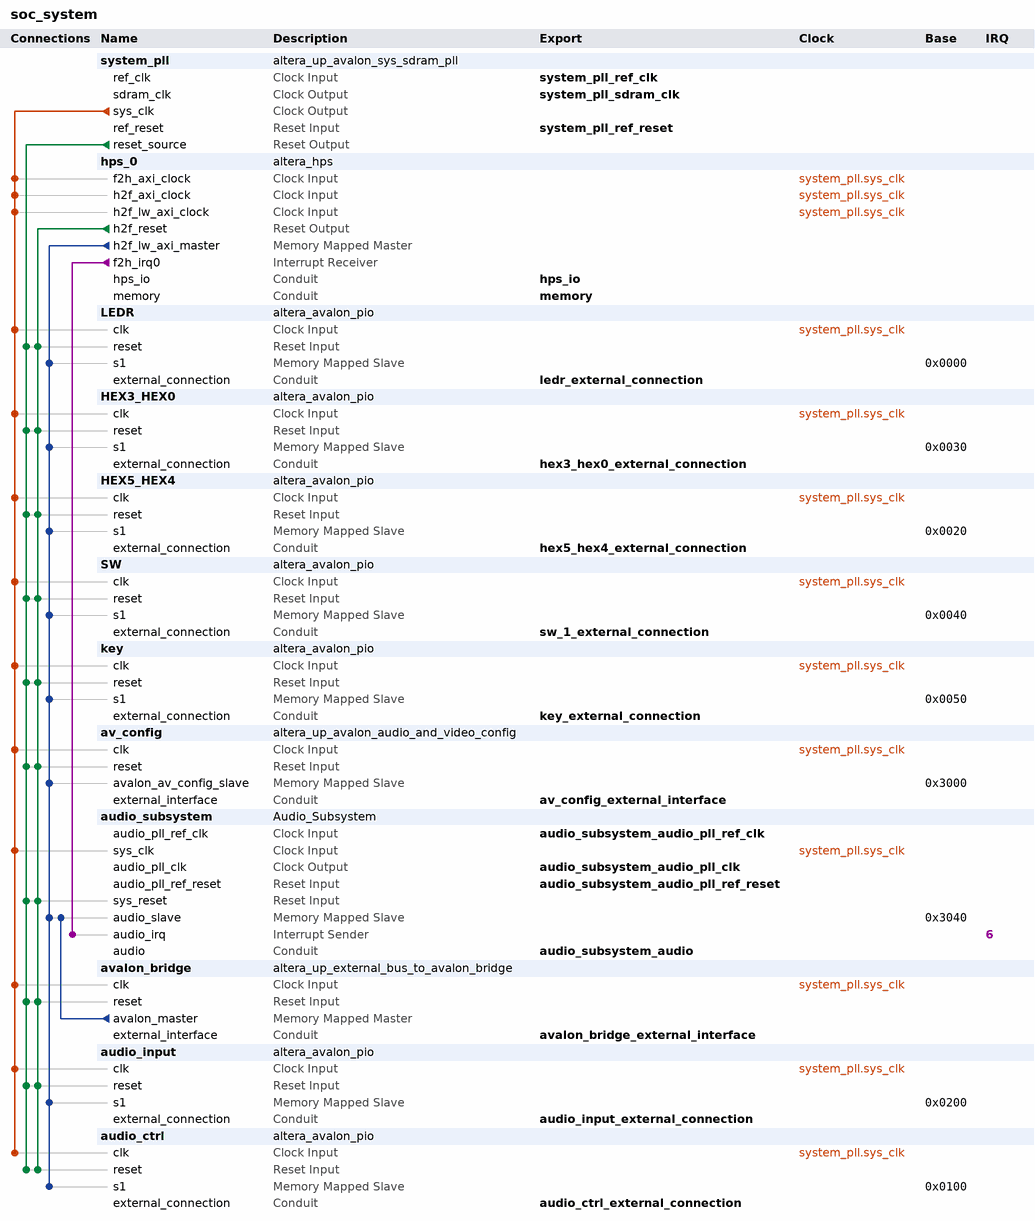
[diagram p0: system contents]
# Platform Designer (Qsys) system soc_system, Cyclone V 5CSEMA5F31C6
# Parameters at their usual value, and those the tool derives, are not listed.
package require -exact qsys 17.1
create_system soc_system
set_project_property DEVICE_FAMILY {Cyclone V}
set_project_property DEVICE 5CSEMA5F31C6

add_instance system_pll altera_up_avalon_sys_sdram_pll 17.0
set_instance_parameter_value system_pll CV_boards DE1-SoC
set_instance_parameter_value system_pll gui_outclk 100.0
set_instance_parameter_value system_pll gui_refclk 50.0

add_instance hps_0 altera_hps 17.1
set_instance_parameter_value hps_0 EMAC1_Mode RGMII
set_instance_parameter_value hps_0 EMAC1_PinMuxing {HPS I/O Set 0}
set_instance_parameter_value hps_0 F2SCLK_COLDRST_Enable false
set_instance_parameter_value hps_0 F2SCLK_DBGRST_Enable false
set_instance_parameter_value hps_0 F2SCLK_WARMRST_Enable false
set_instance_parameter_value hps_0 F2SINTERRUPT_Enable true
set_instance_parameter_value hps_0 F2S_Width 2
set_instance_parameter_value hps_0 FPGA_PERIPHERAL_OUTPUT_CLOCK_FREQ_EMAC0_GTX_CLK 125
set_instance_parameter_value hps_0 FPGA_PERIPHERAL_OUTPUT_CLOCK_FREQ_EMAC0_MD_CLK 2.5
set_instance_parameter_value hps_0 FPGA_PERIPHERAL_OUTPUT_CLOCK_FREQ_EMAC1_GTX_CLK 125
set_instance_parameter_value hps_0 FPGA_PERIPHERAL_OUTPUT_CLOCK_FREQ_EMAC1_MD_CLK 2.5
set_instance_parameter_value hps_0 HPS_PROTOCOL DDR3
set_instance_parameter_value hps_0 I2C0_Mode I2C
set_instance_parameter_value hps_0 I2C0_PinMuxing {HPS I/O Set 0}
set_instance_parameter_value hps_0 I2C1_Mode I2C
set_instance_parameter_value hps_0 I2C1_PinMuxing {HPS I/O Set 0}
set_instance_parameter_value hps_0 LWH2F_Enable true
set_instance_parameter_value hps_0 MEM_BANKADDR_WIDTH 3
set_instance_parameter_value hps_0 MEM_CLK_FREQ 400.0
set_instance_parameter_value hps_0 MEM_COL_ADDR_WIDTH 10
set_instance_parameter_value hps_0 MEM_DQ_WIDTH 32
set_instance_parameter_value hps_0 MEM_DRV_STR RZQ/7
set_instance_parameter_value hps_0 MEM_ROW_ADDR_WIDTH 15
set_instance_parameter_value hps_0 MEM_RTT_NOM RZQ/4
set_instance_parameter_value hps_0 MEM_RTT_WR RZQ/4
set_instance_parameter_value hps_0 MEM_TCL 11
set_instance_parameter_value hps_0 MEM_TFAW_NS 30.0
set_instance_parameter_value hps_0 MEM_TRAS_NS 35.0
set_instance_parameter_value hps_0 MEM_TRCD_NS 13.75
set_instance_parameter_value hps_0 MEM_TRFC_NS 260.0
set_instance_parameter_value hps_0 MEM_TRP_NS 13.75
set_instance_parameter_value hps_0 MEM_VENDOR JEDEC
set_instance_parameter_value hps_0 MEM_WTCL 8
set_instance_parameter_value hps_0 QSPI_Mode {1 SS}
set_instance_parameter_value hps_0 QSPI_PinMuxing {HPS I/O Set 0}
set_instance_parameter_value hps_0 REF_CLK_FREQ 25.0
set_instance_parameter_value hps_0 S2FCLK_USER2CLK 5
set_instance_parameter_value hps_0 S2F_Width 3
set_instance_parameter_value hps_0 SDIO_Mode {4-bit Data}
set_instance_parameter_value hps_0 SDIO_PinMuxing {HPS I/O Set 0}
set_instance_parameter_value hps_0 SPIM1_Mode {Single Slave Select}
set_instance_parameter_value hps_0 SPIM1_PinMuxing {HPS I/O Set 0}
set_instance_parameter_value hps_0 STM_Enable false
set_instance_parameter_value hps_0 TIMING_BOARD_AC_SKEW 0.03
set_instance_parameter_value hps_0 TIMING_BOARD_AC_TO_CK_SKEW 0.0
set_instance_parameter_value hps_0 TIMING_BOARD_DQ_TO_DQS_SKEW 0.0
set_instance_parameter_value hps_0 TIMING_BOARD_MAX_CK_DELAY 0.03
set_instance_parameter_value hps_0 TIMING_BOARD_MAX_DQS_DELAY 0.02
set_instance_parameter_value hps_0 TIMING_BOARD_SKEW_BETWEEN_DQS 0.08
set_instance_parameter_value hps_0 TIMING_BOARD_SKEW_CKDQS_DIMM_MAX 0.16
set_instance_parameter_value hps_0 TIMING_BOARD_SKEW_CKDQS_DIMM_MIN 0.06
set_instance_parameter_value hps_0 TIMING_BOARD_SKEW_WITHIN_DQS 0.01
set_instance_parameter_value hps_0 TIMING_TDH 65
set_instance_parameter_value hps_0 TIMING_TDQSCK 255
set_instance_parameter_value hps_0 TIMING_TDQSQ 125
set_instance_parameter_value hps_0 TIMING_TDS 30
set_instance_parameter_value hps_0 TIMING_TIH 140
set_instance_parameter_value hps_0 TIMING_TIS 180
set_instance_parameter_value hps_0 TIMING_TQSH 0.4
set_instance_parameter_value hps_0 UART0_Mode {No Flow Control}
set_instance_parameter_value hps_0 UART0_PinMuxing {HPS I/O Set 0}
set_instance_parameter_value hps_0 USB1_Mode SDR
set_instance_parameter_value hps_0 USB1_PinMuxing {HPS I/O Set 0}
set_instance_parameter_value hps_0 desired_cfg_clk_mhz 100.0
set_instance_parameter_value hps_0 desired_qspi_clk_mhz 400.0

add_instance LEDR altera_avalon_pio 17.1
set_instance_parameter_value LEDR direction Output
set_instance_parameter_value LEDR resetValue 1023
set_instance_parameter_value LEDR width 10

add_instance HEX3_HEX0 altera_avalon_pio 17.1
set_instance_parameter_value HEX3_HEX0 direction Output
set_instance_parameter_value HEX3_HEX0 width 32

add_instance HEX5_HEX4 altera_avalon_pio 17.1
set_instance_parameter_value HEX5_HEX4 direction Output
set_instance_parameter_value HEX5_HEX4 width 16

add_instance SW altera_avalon_pio 17.1
set_instance_parameter_value SW direction Input
set_instance_parameter_value SW simDoTestBenchWiring true
set_instance_parameter_value SW width 10

add_instance key altera_avalon_pio 17.1
set_instance_parameter_value key bitClearingEdgeCapReg true
set_instance_parameter_value key captureEdge true
set_instance_parameter_value key direction Input
set_instance_parameter_value key edgeType FALLING
set_instance_parameter_value key generateIRQ true
set_instance_parameter_value key irqType EDGE
set_instance_parameter_value key simDoTestBenchWiring true
set_instance_parameter_value key width 4

add_instance av_config altera_up_avalon_audio_and_video_config 17.0
set_instance_parameter_value av_config audio_in {Microphone to ADC}
set_instance_parameter_value av_config bit_length 32
set_instance_parameter_value av_config board DE1-SoC
set_instance_parameter_value av_config line_in_bypass true
set_instance_parameter_value av_config sampling_rate {48 kHz}

add_instance audio_subsystem Audio_Subsystem 1.0

add_instance avalon_bridge altera_up_external_bus_to_avalon_bridge 17.1
set_instance_parameter_value avalon_bridge addr_size 64
set_instance_parameter_value avalon_bridge addr_size_multiplier Kbytes
set_instance_parameter_value avalon_bridge data_size 32

add_instance audio_input altera_avalon_pio 17.1
set_instance_parameter_value audio_input bitClearingEdgeCapReg true
set_instance_parameter_value audio_input direction Input
set_instance_parameter_value audio_input edgeType FALLING
set_instance_parameter_value audio_input simDoTestBenchWiring true
set_instance_parameter_value audio_input width 32

add_instance audio_ctrl altera_avalon_pio 17.1
set_instance_parameter_value audio_ctrl bitClearingEdgeCapReg true
set_instance_parameter_value audio_ctrl direction Input
set_instance_parameter_value audio_ctrl edgeType FALLING
set_instance_parameter_value audio_ctrl simDoTestBenchWiring true
set_instance_parameter_value audio_ctrl width 16

# connections
add_connection system_pll.sys_clk audio_ctrl.clk clock
add_connection system_pll.sys_clk audio_input.clk clock
add_connection system_pll.sys_clk audio_subsystem.sys_clk clock
add_connection system_pll.sys_clk av_config.clk clock
add_connection system_pll.sys_clk avalon_bridge.clk clock
add_connection system_pll.sys_clk HEX3_HEX0.clk clock
add_connection system_pll.sys_clk HEX5_HEX4.clk clock
add_connection system_pll.sys_clk hps_0.f2h_axi_clock clock
add_connection system_pll.sys_clk hps_0.h2f_axi_clock clock
add_connection system_pll.sys_clk hps_0.h2f_lw_axi_clock clock
add_connection system_pll.sys_clk key.clk clock
add_connection system_pll.sys_clk LEDR.clk clock
add_connection system_pll.sys_clk SW.clk clock
add_connection hps_0.h2f_reset audio_ctrl.reset reset
add_connection hps_0.h2f_reset audio_input.reset reset
add_connection hps_0.h2f_reset audio_subsystem.sys_reset reset
add_connection hps_0.h2f_reset av_config.reset reset
add_connection hps_0.h2f_reset avalon_bridge.reset reset
add_connection hps_0.h2f_reset HEX3_HEX0.reset reset
add_connection hps_0.h2f_reset HEX5_HEX4.reset reset
add_connection hps_0.h2f_reset key.reset reset
add_connection hps_0.h2f_reset LEDR.reset reset
add_connection hps_0.h2f_reset SW.reset reset
add_connection system_pll.reset_source audio_ctrl.reset reset
add_connection system_pll.reset_source audio_input.reset reset
add_connection system_pll.reset_source audio_subsystem.sys_reset reset
add_connection system_pll.reset_source av_config.reset reset
add_connection system_pll.reset_source avalon_bridge.reset reset
add_connection system_pll.reset_source HEX3_HEX0.reset reset
add_connection system_pll.reset_source HEX5_HEX4.reset reset
add_connection system_pll.reset_source key.reset reset
add_connection system_pll.reset_source LEDR.reset reset
add_connection system_pll.reset_source SW.reset reset
add_connection avalon_bridge.avalon_master audio_subsystem.audio_slave avalon
set_connection_parameter_value avalon_bridge.avalon_master/audio_subsystem.audio_slave baseAddress 0x3040
add_connection hps_0.h2f_lw_axi_master audio_ctrl.s1 avalon
set_connection_parameter_value hps_0.h2f_lw_axi_master/audio_ctrl.s1 baseAddress 0x0100
add_connection hps_0.h2f_lw_axi_master audio_input.s1 avalon
set_connection_parameter_value hps_0.h2f_lw_axi_master/audio_input.s1 baseAddress 0x0200
add_connection hps_0.h2f_lw_axi_master audio_subsystem.audio_slave avalon
set_connection_parameter_value hps_0.h2f_lw_axi_master/audio_subsystem.audio_slave baseAddress 0x3040
add_connection hps_0.h2f_lw_axi_master av_config.avalon_av_config_slave avalon
set_connection_parameter_value hps_0.h2f_lw_axi_master/av_config.avalon_av_config_slave baseAddress 0x3000
add_connection hps_0.h2f_lw_axi_master HEX3_HEX0.s1 avalon
set_connection_parameter_value hps_0.h2f_lw_axi_master/HEX3_HEX0.s1 baseAddress 0x0030
add_connection hps_0.h2f_lw_axi_master HEX5_HEX4.s1 avalon
set_connection_parameter_value hps_0.h2f_lw_axi_master/HEX5_HEX4.s1 baseAddress 0x0020
add_connection hps_0.h2f_lw_axi_master key.s1 avalon
set_connection_parameter_value hps_0.h2f_lw_axi_master/key.s1 baseAddress 0x0050
add_connection hps_0.h2f_lw_axi_master LEDR.s1 avalon
set_connection_parameter_value hps_0.h2f_lw_axi_master/LEDR.s1 baseAddress 0x0000
add_connection hps_0.h2f_lw_axi_master SW.s1 avalon
set_connection_parameter_value hps_0.h2f_lw_axi_master/SW.s1 baseAddress 0x0040
add_connection hps_0.f2h_irq0 audio_subsystem.audio_irq interrupt
set_connection_parameter_value hps_0.f2h_irq0/audio_subsystem.audio_irq irqNumber 6

# exported interfaces
add_interface audio_ctrl_external_connection conduit end
set_interface_property audio_ctrl_external_connection EXPORT_OF audio_ctrl.external_connection
add_interface audio_input_external_connection conduit end
set_interface_property audio_input_external_connection EXPORT_OF audio_input.external_connection
add_interface audio_subsystem_audio conduit end
set_interface_property audio_subsystem_audio EXPORT_OF audio_subsystem.audio
add_interface audio_subsystem_audio_pll_clk clock source
set_interface_property audio_subsystem_audio_pll_clk EXPORT_OF audio_subsystem.audio_pll_clk
add_interface audio_subsystem_audio_pll_ref_clk clock sink
set_interface_property audio_subsystem_audio_pll_ref_clk EXPORT_OF audio_subsystem.audio_pll_ref_clk
add_interface audio_subsystem_audio_pll_ref_reset reset sink
set_interface_property audio_subsystem_audio_pll_ref_reset EXPORT_OF audio_subsystem.audio_pll_ref_reset
add_interface av_config_external_interface conduit end
set_interface_property av_config_external_interface EXPORT_OF av_config.external_interface
add_interface avalon_bridge_external_interface conduit end
set_interface_property avalon_bridge_external_interface EXPORT_OF avalon_bridge.external_interface
add_interface hex3_hex0_external_connection conduit end
set_interface_property hex3_hex0_external_connection EXPORT_OF HEX3_HEX0.external_connection
add_interface hex5_hex4_external_connection conduit end
set_interface_property hex5_hex4_external_connection EXPORT_OF HEX5_HEX4.external_connection
add_interface hps_io conduit end
set_interface_property hps_io EXPORT_OF hps_0.hps_io
add_interface key_external_connection conduit end
set_interface_property key_external_connection EXPORT_OF key.external_connection
add_interface ledr_external_connection conduit end
set_interface_property ledr_external_connection EXPORT_OF LEDR.external_connection
add_interface memory conduit end
set_interface_property memory EXPORT_OF hps_0.memory
add_interface sw_1_external_connection conduit end
set_interface_property sw_1_external_connection EXPORT_OF SW.external_connection
add_interface system_pll_ref_clk clock sink
set_interface_property system_pll_ref_clk EXPORT_OF system_pll.ref_clk
add_interface system_pll_ref_reset reset sink
set_interface_property system_pll_ref_reset EXPORT_OF system_pll.ref_reset
add_interface system_pll_sdram_clk clock source
set_interface_property system_pll_sdram_clk EXPORT_OF system_pll.sdram_clk

set_interconnect_requirement {$system} qsys_mm.clockCrossingAdapter HANDSHAKE
set_interconnect_requirement {$system} qsys_mm.enableEccProtection FALSE
set_interconnect_requirement {$system} qsys_mm.insertDefaultSlave FALSE
set_interconnect_requirement {$system} qsys_mm.maxAdditionalLatency 1

save_system soc_system.qsys
